# EAGLE schematic mux_switch (EAGLE 9.6.2)
COMPANY: ADAFRUIT INDUSTRIES; DRAWN: KTOWN; REV: A
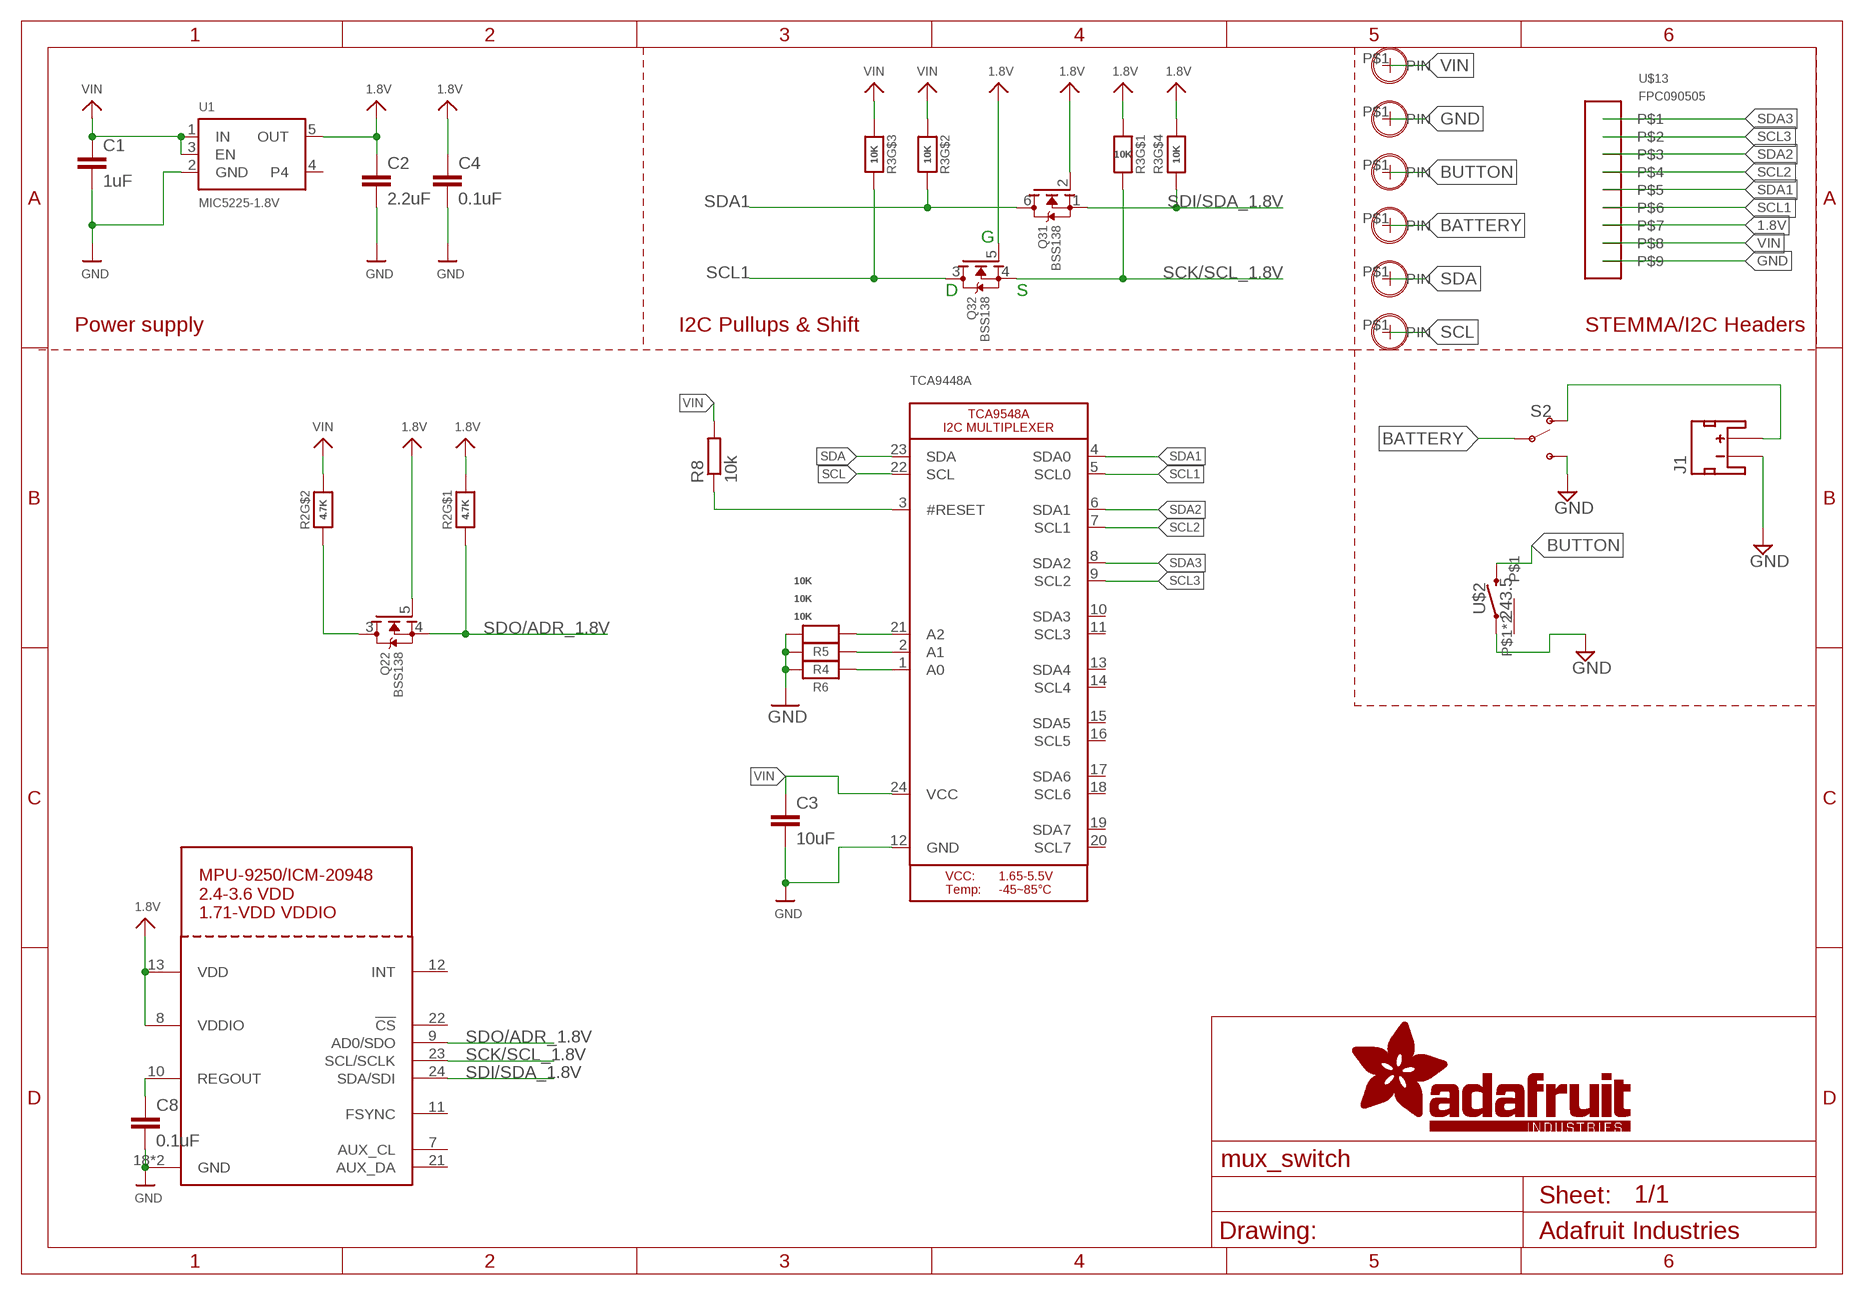
[diagram p0: schematic, sheet 1]

## Parts
C1  1uF  C-EUC0402  [C0402]
C2  2.2uF  C-EUC0402  [C0402]
C3  10uF  C-EUC0402  [C0402]
C4  0.1uF  C-EUC0402  [C0402]
C8  0.1uF  C-EUC0402  [C0402]
J1  JST_2MM_MALE  [JST-2-SMD]
Q2  BSS138  MOSFET-N_DUAL  [SOT363]
Q3  BSS138  MOSFET-N_DUAL  [SOT363]
R2  4.7K  RESISTOR_4PACK  [RESPACK_4X0603]
R3  10K  RESISTOR_4PACK  [RESPACK_4X0603]
R4  10K  RESISTOR0805_NOOUTLINE  [0805-NO]
R5  10K  RESISTOR0805_NOOUTLINE  [0805-NO]
R6  10K  RESISTOR0805_NOOUTLINE  [0805-NO]
R8  10k  R-EU_R0805  [R0805]
S2  SWITCH-SPDT-SMD-RIGHT-ANGLE  [SWITCH_SPST_SMD_A]
TCA9448A  MICROBUILDER_TCA9548A  [MICROBUILDER_TSSOP24]
U1  MIC5225-1.8V  VREG_SOT23-5  [SOT23-5]
U$2  243.5  [2*4*3.5]
U$3  M0.9-HOLE0.9MM  [M0.9-HOLE]
U$6  M0.9-HOLE0.9MM  [M0.9-HOLE]
U$8  M0.9-HOLE0.9MM  [M0.9-HOLE]
U$9  M0.9-HOLE0.9MM  [M0.9-HOLE]
U$10  M0.9-HOLE0.9MM  [M0.9-HOLE]
U$12  M0.9-HOLE0.9MM  [M0.9-HOLE]
U$13  FPC090505  [FPC0905]
U$21  MPU-9250_ICM20948  [QFN24_3MM_NOEP]

## Nets
1.8V: C2.1 C4.1 Q2.5(2:G) Q3.2(1:G) Q3.5(2:G) R2.8 R3.4 R3.8 U1.5(OUT) U$13.P$7 U$21.8(VDDIO) U$21.13(VDD)
BATTERY: S2.2(P) U$10.P$1(PIN)
BUTTON: U$2.P$4 U$9.P$1(PIN)
GND: C1.2 C2.2 C3.2 C4.2 C8.2 J1.1(-) R4.2 R5.2 R6.2 S2.3(S) TCA9448A.12(GND) U1.2(GND) U$2.P$3 U$8.P$1(PIN) U$13.P$9 U$21.18(GND) U$21.20(GND)
N$2: R5.1 TCA9448A.21(A2)
N$3: J1.2(+) S2.1(O)
N$4: R4.1 TCA9448A.2(A1)
N$5: R6.1 TCA9448A.1(A0)
REGOUT: C8.1 U$21.10(REGOUT)
RESET: R8.1 TCA9448A.3(#RESET)
SCK/SCL_1.8V: Q3.4(2:S) R3.1 U$21.23(SCL/SCLK)
SCL: TCA9448A.22(SCL) U$12.P$1(PIN)
SCL1: Q3.3(2:D) R3.6 TCA9448A.5(SCL0) U$13.P$6
SCL2: TCA9448A.7(SCL1) U$13.P$4
SCL3: TCA9448A.9(SCL2) U$13.P$2
SDA: TCA9448A.23(SDA) U$6.P$1(PIN)
SDA1: Q3.6(1:D) R3.7 TCA9448A.4(SDA0) U$13.P$5
SDA2: TCA9448A.6(SDA1) U$13.P$3
SDA3: TCA9448A.8(SDA2) U$13.P$1
SDI/SDA_1.8V: Q3.1(1:S) R3.5 U$21.24(SDA/SDI)
SDO/ADR: Q2.3(2:D) R2.2
SDO/ADR_1.8V: Q2.4(2:S) R2.1 U$21.9(AD0/SDO)
VIN [highpower]: C1.1 C3.1 R2.7 R3.2 R3.3 R8.2 TCA9448A.24(VCC) U1.1(IN) U1.3(EN) U$3.P$1(PIN) U$13.P$8
Unconnected: J1.NC1(PAD1) J1.NC2(PAD2) Q2.1(1:S) Q2.2(1:G) Q2.6(1:D) R2.3 R2.4 R2.5 R2.6 TCA9448A.10(SDA3) TCA9448A.11(SCL3) TCA9448A.13(SDA4) TCA9448A.14(SCL4) TCA9448A.15(SDA5) TCA9448A.16(SCL5) TCA9448A.17(SDA6) TCA9448A.18(SCL6) TCA9448A.19(SDA7) TCA9448A.20(SCL7) U1.4 U$2.P$1 U$2.P$2 U$21.7(AUX_CL) U$21.11(FSYNC) U$21.12(INT) U$21.21(AUX_DA) U$21.22(!CS)

## Notes on the sheet
- G
- D | S
- Power supply | I2C Pullups & Shift | STEMMA/I2C Headers

## Library data of the parts
C1-C4 C8 = rcl:C-EU: CAPACITOR, European symbol; SPICEPREFIX: C
J1 = SparkFun-Connectors:JST_2MM_MALE: JST 2MM MALE RA CONNECTOR Two pin, compact surface mount connector. Commonly used as a battery input connection point. We really like the solid locking feeling and high current rating on these small connectors. We use these all the time as battery connectors. Mates to single-cell LiPo batteries. Here is the connector we sell at SparkFun: JST Right Angle Connector - White <https://www.sparkfun.com/products/8612> (PRT-08612) Datasheet <http://www.sparkfun.com/datasheets/Prototyping/Connectors/JST-Horizontal.pdf> It was used on these SparkFun products: SparkFun MOSFET Power Controller <https://www.sparkfun.com/products/11214> (PRT-11214) SparkFun Battery Babysitter - LiPo Battery Manager <https://www.sparkfun.com/products/13777> (PRT-13777) And many, many others that required a lipo battery connection.; PROD_ID: CONN-11443; SF_ID: PRT-08612
Q2 Q3 = microbuilder:MOSFET-N_DUAL: Dual N-Channel MOSFET SOT363 (2.0x1.25mm) 2N7002PS - 60V, 320mA [Digikey: 568-5984-1-ND]
R2 R3 = microbuilder:RESISTOR_4PACK: Resistor Packs (4 resistors) 4 x 0603 10K 1/16W - Digikey: YC164J-10KCT-ND
R4-R6 = microbuilder:RESISTOR: Resistors For new designs, use the packages preceded by an '_' character since they are more reliable: The following footprints should be used on most boards: _0402 - Standard footprint for regular board layouts _0603 - Standard footprint for regular board layouts _0805 - Standard footprint for regular board layouts _1206 - Standard footprint for regular board layouts For extremely tight-pitch boards where space is at a premium, the following 'micro-pitch' footprints can be used (smaller pads, no silkscreen outline, etc.): _0402MP - Micro-pitch footprint for very dense/compact boards _0603MP - Micro-pitch footprint for very dense/compact boards _0805MP - Micro-pitch footprint for very dense/compact boards _1206MP - Micro-pitch footprint for very dense/compact boards
R8 = rcl:R-EU_: RESISTOR, European symbol; SPICEPREFIX: R
S2 = SparkFun-Switches:SWITCH-SPDT: Single Pole, Double Throw (SPDT) Switch Single-pole, double-throw (SPDT) switch. Variant Overview SMD-AYZ0202 Surface Mount DPDT Switch <https://www.sparkfun.com/products/597> (COM-00597) Used on e.g. LilyPad Arduino USB - ATmega32U4 Board <https://www.sparkfun.com/products/12049> PTH-11.6X4.0MM SPDT Mini Power Switch <https://www.sparkfun.com/products/102> (COM-00102) Used on e.g. SparkFun Simon Says - Through-Hole Soldering Kit <https://www.sparkfun.com/products/10547> (KIT-10547) PTH-11.6X4.0MM-KIT KIT version of SPDT Mini Power Switch - Simplifies soldering by removing tStop of switch pins - only one side can be soldered. PTH-11.6X4.0MM-LOCK LOCK version of SPDT Mini Power Switch - Offset pins hold switch in place for easier soldering. SMD-RIGHT-ANGLE Surface Mount Right Angle Switch <https://www.sparkfun.com/products/10860> (COM-10860) Used on e.g. SparkFun ESP8266 Thing <https://www.sparkfun.com/products/13231>; PROD_ID: SWCH-10651; SF_SKU: COM-10860
TCA9448A = Adafruit TCA9548A:MICROBUILDER_TCA9548A: TCA9548A I2C Multiplexer
U1 = microbuilder:VREG_SOT23-5: SOT23-5 Fixed Voltage Regulators Part Current Out V Out V In V Dropout θJA (°C/W) TJ (°C) Digikey Part No. ADP121 150mA 3.3V 3.4-5.5V 0.09V @ 150mA -- -- ADP121-AUJZ33R7CT-ND ADP121 150mA 3.0V 3.1-5.5V 0.09V @ 150mA -- -- ADP121-AUJZ30R7CT-ND ADP122 300mA 3.3V 3.4-5.5V 0.085V @ 300mA -- -- ADP122AUJZ-3.3-R7CT-ND ADP1712 300mA 3.3V 3.5-5.5V 0.17V @ 300mA -- -- ADP1712AUJZ-3.3-R7TR-ND AP7311 (Low Cost) 150mA 3.3V 3.5-6V 0.15V @ 150mA -- -- AP7311-33WG-7DICT-ND LD39015M18R 150mA 1.8V 1.9V-5.5V 0.08V @ 100mA -- -- 497-6977-1-ND LP2985A-33DBVR 150mA 3.3V 3.3-16V 0.28V @ 150mA 206 150 296-18479-1-ND MCP1824T-3302E/OT 300mA 3.3V 3.5V-6V 0.2V @ 300mA -- -- MCP1824T-3302E/OTCT-ND MIC5205-2.5YM5 TR 150mA 2.5V 2.7-16V 0.165V @ 150mA -- -- 576-1257-2-ND MIC5205-3.0YM5 TR 150mA 3.0V 3.2V-16V 0.165V @ 150mA -- -- 576-1258-2-ND MIC5205-3.3YM5 TR 150mA 3.3V 3.5V-16V 0.165V @ 150mA -- -- 576-1259-2-ND TPS780330220 150mA 3.3V+2.2V 3.6-5.5V 250mV Max -- -- 296-23332-1-ND TDA3663/N1,135 100mA 3.3V 3.5-45V 0.18V @ 50mA -- -- 568-5343-1-ND Max operating temp can be calculated using θJA, TJ (max junction temperature), and power in watts. Set the "Maximum Ambient Temperature" until it reaches TJ ("Max Junction Temperature"), which is the absolute limit for safe use of the regulator: Heat Sink Temperature Calculator <http://www.daycounter.com/Calculators/Heat-Sink-Temperature-Calculator.phtml> For example, With 12V source into a 3.3V LP2985 and a 30mA load, we are dissipating (12V-3.3V) * 0.03A = 0.261W. With a θJA of 206 °C/W, a TJ of 150°C, and 261mW we can safely use the chip without a heat sink up to 75°C (=147.1°C Junction Temperature).
U$2 = 2x4x3.5sw:2*4*3.5
U$3 U$6 U$8-U$10 U$12 = M3-Hole:M0.9-HOLE
U$13 = my_library:FPC0905
U$21 = adafruit_sensor:MPU-9250: MPU-9250 3-Axis gyroscope and 3-Axis accelerometer

## Net classes
1 highpower: width 0.254 mm, drill 0.483 mm
2 lowpower: width 0.203 mm, drill 0.483 mm